# Altium schematic sheet Master Sheet.SchDoc
size A
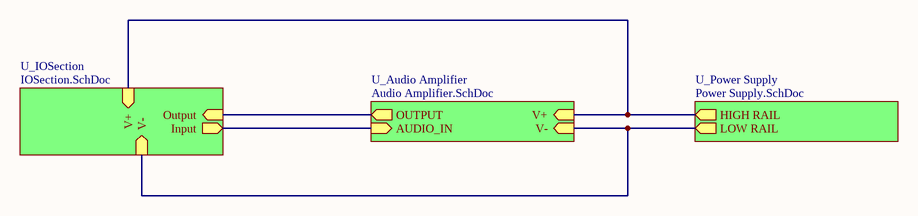
[diagram p0: Master Sheet.SchDoc]

## Sub-sheets
U_Audio Amplifier = Audio Amplifier.SchDoc: V+ (in), V- (in), AUDIO_IN (in), OUTPUT (out)
U_IOSection = IOSection.SchDoc: Output (in), Input (out), V+ (in), V- (in)
U_Power Supply = Power Supply.SchDoc: HIGH RAIL (out), LOW RAIL (out)

## Nets
(unnamed): sheet U_Audio Amplifier/V+, sheet U_Power Supply/HIGH RAIL, sheet U_IOSection/V+
(unnamed): sheet U_Audio Amplifier/V-, sheet U_Power Supply/LOW RAIL, sheet U_IOSection/V-
(unnamed): sheet U_Audio Amplifier/AUDIO_IN, sheet U_IOSection/Input
(unnamed): sheet U_Audio Amplifier/OUTPUT, sheet U_IOSection/Output